# Altium schematic sheet 3_power.SchDoc
size A4; SheetNumber: 3; SheetTotal: 8
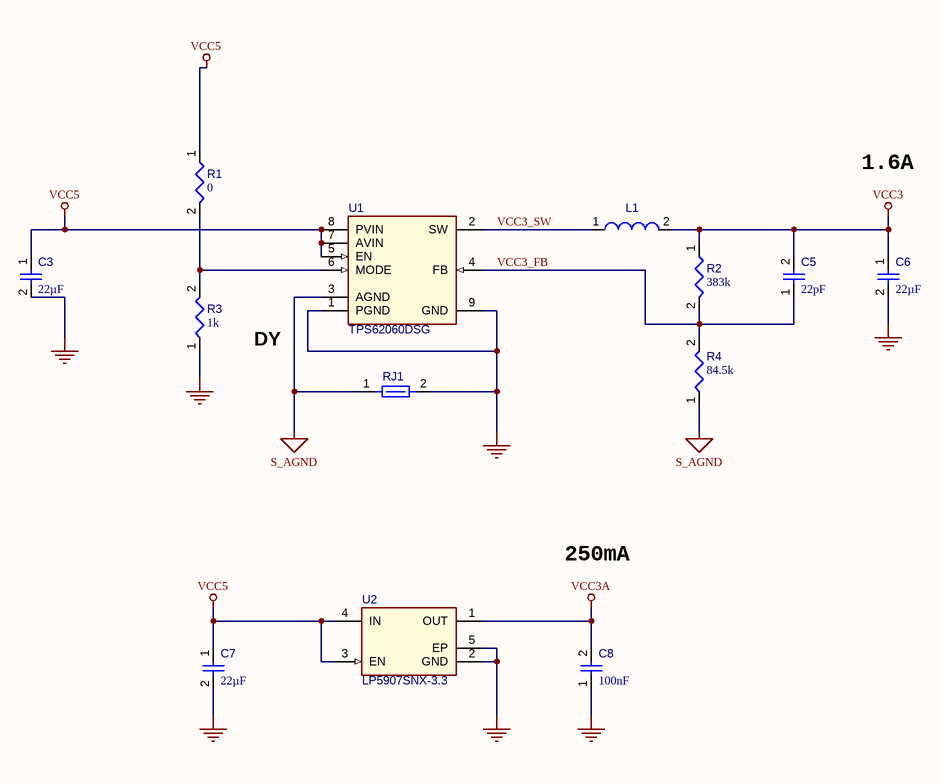
[diagram p0: 3_power.SchDoc]

## Parts
C3  value 22µF  [CAPC0805(2012)145_L]  (hidden comment: Capacitor 22µF +/-40% 16V 0805)
C5  value 22pF  [CAPC0402(1005)60_L]  (hidden comment: Capacitor 22pF +/-10% 50V 0402)
C6  value 22µF  [CAPC0805(2012)145_L]  (hidden comment: Capacitor 22µF +/-40% 16V 0805)
C7  value 22µF  [CAPC0805(2012)145_L]  (hidden comment: Capacitor 22µF +/-40% 16V 0805)
C8  value 100nF  [CAPC0402(1005)60_L]  (hidden comment: Capacitor 100nF +/-20% 10V 0402)
L1  VLS252010HBX-2R2M-1  [TDK-VLS252010_V]  (value not drawn)
R1  value 0  [RESC0402(1005)_L]  (hidden comment: Jumper 0402)
R2  value 383k  [RESC0402(1005)_L]  (hidden comment: Resistor 383K +/-1 % 0402 63 mW)
R3  value 1k  [RESC0402(1005)_L]  (hidden comment: Resistor 1K +/-5 % 0402 63 mW)
R4  value 84.5k  [RESC0402(1005)_L]  (hidden comment: Resistor 84K5 +/-1 % 0402 63 mW)
RJ1  Net Tie 10x8mil  [New footprint 1]  (value not drawn)  (net tie, no BOM)
U1  TPS62060DSG  [DSG0008A_V]
U2  LP5907SNX-3.3  [TI-DQN4-480X480TP_V]

## Nets
GND: C3.2 C6.2 C7.2 C8.1 R3.1 RJ1.2 U1.1(PGND) U1.9(GND) U2.2(GND) U2.5(EP)
S_AGND: R4.1 RJ1.1 U1.3(AGND)
VCC3: C5.2 C6.1 L1.2 R2.1
VCC3A: C8.2 U2.1(OUT)
VCC5: C3.1 C7.1 R1.1 U1.5(EN) U1.7(AVIN) U1.8(PVIN) U2.3(EN) U2.4(IN)
VCC3_FB: C5.1 R2.2 R4.2 U1.4(FB)
VCC3_SW: L1.1 U1.2(SW)
NetR1_2: R1.2 R3.2 U1.6(MODE)

## Notes on the sheet
- 1.6A
- DY
- 250mA
- Title
- Size:
- Date:
- A4
- Number:
- Time:
- Revision:
- Sheet
- of
- File:

## Library data of the parts
C3 C6 C7 = CMP-001-00081-9: Chip Capacitor, 22µF +/-40%, 16V, 0805, Thickness 1.45 mm; Manufacturer 1: Samsung; Manufacturer Lifecycle 1: Not Recommended for New Design; Manufacturer Part Number 1: CL21A226MOQNNNE; Tolerance: 5%; Moeda: USD; Preço: 1: 0.123; Preço: 10: 3.69; Preço:100: 22.2; Preço:1000: 159; Voltage Rating: 16V; Case/Package: 0402; Pins: 2; Mounting Technology: SMT; Max Operating Temperature: 85°C; Min Operating Temperature: -55°C; Quantity: 323
C5 = CMP-001-00073-9: Chip Capacitor, 22pF +/-10%, 50V, 0402, Thickness 0.6 mm; Manufacturer 1: Kyocera AVX; Manufacturer Lifecycle 1: Volume Production; Manufacturer Part Number 1: 04025A220JAT4A; Tolerance: 10%; Moeda: USD; Preço: 1: 0.017; Preço: 10: 0.17; Preço:100: 0.9; Preço:1000: 5; Mounting Technology: SMT; Pins: 2; Voltage Rating: 50V; Case/Package: 0402; Max Operating Temperature: 85°C; Min Operating Temperature: -55°C; Quantity: 871
C8 = CMP-001-00061-9: Chip Capacitor, 100nF +/-20%, 10V, 0402, Thickness 0.6 mm; Manufacturer 1: KEMET; Manufacturer Lifecycle 1: Volume Production; Manufacturer Part Number 1: C0402C104K8RACTU; Tolerance: 20%; Moeda: USD; Preço: 1: 0.013; Preço: 10: 3.38; Preço:100: 28.6; Preço:1000: 130; Case/Package: 0402; Min Operating Temperature: -55°C; Mounting Technology: SMT; Max Operating Temperature: 85°C; Pins: 2; Voltage Rating: 10V; Imagem: https://sigma.octopart.com/cdn-cgi/image/width=75,fit=contain,quality=85,format=auto/10190940/image/Kemet-C0402C104K8RACTU.jpg; Quantity: 26
L1 = CMP-006-00020-3: Inductor for Power Circuit, 2.2 uH, +/- 20%, -40 to 105 degC, 2-Pin SMD, RoHS, Tape and Reel; Manufacturer 1: TDK; Manufacturer Lifecycle 1: Volume Production; Value: 2.2µH; Moeda: USD; Preço: 1: 0.219; Preço: 10: 2.19; Preço:100: 16.1; Preço:1000: 133; Tolerance: 20%; Mounting Technology: SurfaceMount; Pins: 2; Manufacturer Part Number 1: VLS252010HBX-2R2M-1; Quantity: 23
R1 = CMP-009-00148-4: Manufacturer 1: Yageo; Manufacturer Lifecycle 1: Volume Production; Manufacturer Part Number 1: RC0402JR-070RL; __ORIG_LIFECYCLESTATEGUID__: 706004B5-C76E-482E-903B-BA0E4FAE086A; Moeda: USD; Preço: 1: 0.007; Preço: 10: 0.07; Preço:100: 0.3; Preço:1000: 3; SKA: 12358745; Case/Package: 0402; Max Operating Temperature: 155°C; Min Operating Temperature: -55°C; Pins: 2; Quantity: 75
R2 = CMP-009-00126-3: Chip Resistor, 383 kOhms, +/-1 %, 63 mW, -55 to 155 degC, 0402; Manufacturer 1: Yageo; Manufacturer Lifecycle 1: Volume Production; Manufacturer Part Number 1: RC0402FR-07383KL; Tolerance: 1%; Power: 63mW; __ORIG_LIFECYCLESTATEGUID__: 706004B5-C76E-482E-903B-BA0E4FAE086A; Moeda: USD; Preço: 1: 0.009; Preço: 10: 0.09; Preço:100: 0.5; Preço:1000: 5; Case/Package: 0402; Max Operating Temperature: 155°C; Min Operating Temperature: -55°C; Pins: 2; Quantity: 21
R3 = CMP-009-00157-3: Chip Resistor, 1 kOhms, +/-5 %, 63 mW, -55 to 155 degC, 0402; Manufacturer 1: Yageo; Manufacturer Lifecycle 1: Volume Production; Manufacturer Part Number 1: RC0402JR-071KL; Tolerance: 5%; Power: 63mW; __ORIG_LIFECYCLESTATEGUID__: 706004B5-C76E-482E-903B-BA0E4FAE086A; Moeda: USD; Preço: 1: 0.011; Preço: 10: 0.44; Preço:100: 2.4; Preço:1000: 16; Case/Package: 0402; Max Operating Temperature: 155°C; Min Operating Temperature: -55°C; Pins: 2; Quantity: 23
R4 = CMP-009-00130-3: Chip Resistor, 84,5 kOhms, +/-1 %, 63 mW, -55 to 155 degC, 0402; Manufacturer 1: Bourns; Manufacturer Lifecycle 1: Volume Production; Manufacturer Part Number 1: CR0402-FX-8452GLF; Tolerance: 1%; Power: 63mW; __ORIG_LIFECYCLESTATEGUID__: 706004B5-C76E-482E-903B-BA0E4FAE086A; Moeda: USD; Preço: 1: 0.008; Preço: 10: 0.08; Preço:100: 0.5; Preço:1000: 35; Case/Package: 0402; Max Operating Temperature: 155°C; Min Operating Temperature: -55°C; Pins: 2; Quantity: 351
RJ1 = CMP-009-00116-1: Pins: 2; Max Operating Temperature: 155°C; Min Operating Temperature: -55°C; ComponentLink1Description: New link; ComponentLink1URL: *
U1 = CMP-019-00038-1: Step Down Converter, 3 MHz, 1.6 A, -45 to 85 degC, 8-Pin WSON, RoHS, Tape and Reel; Pins: 9
U2 = CMP-019-00040-2: Ultra-Low-Noise, Low-IQ LDO, 3.3 V, 0.25 A, -40 to 125 degC, 4-Pin X2SON, RoHS, Tape and Reel; Manufacturer 1: Texas Instruments; Manufacturer Lifecycle 1: Volume Production; Manufacturer Part Number 1: LP5907SNX-3.3/NOPB; Output Voltage: 3.3V; Moeda: USD; Preço: 1: 0.513; Preço: 10: 5.13; Preço:100: 38.3; Preço:1000: 238; Min Operating Temperature: -40°C; Pins: 5; Max Operating Temperature: 125°C; Quantity: 771